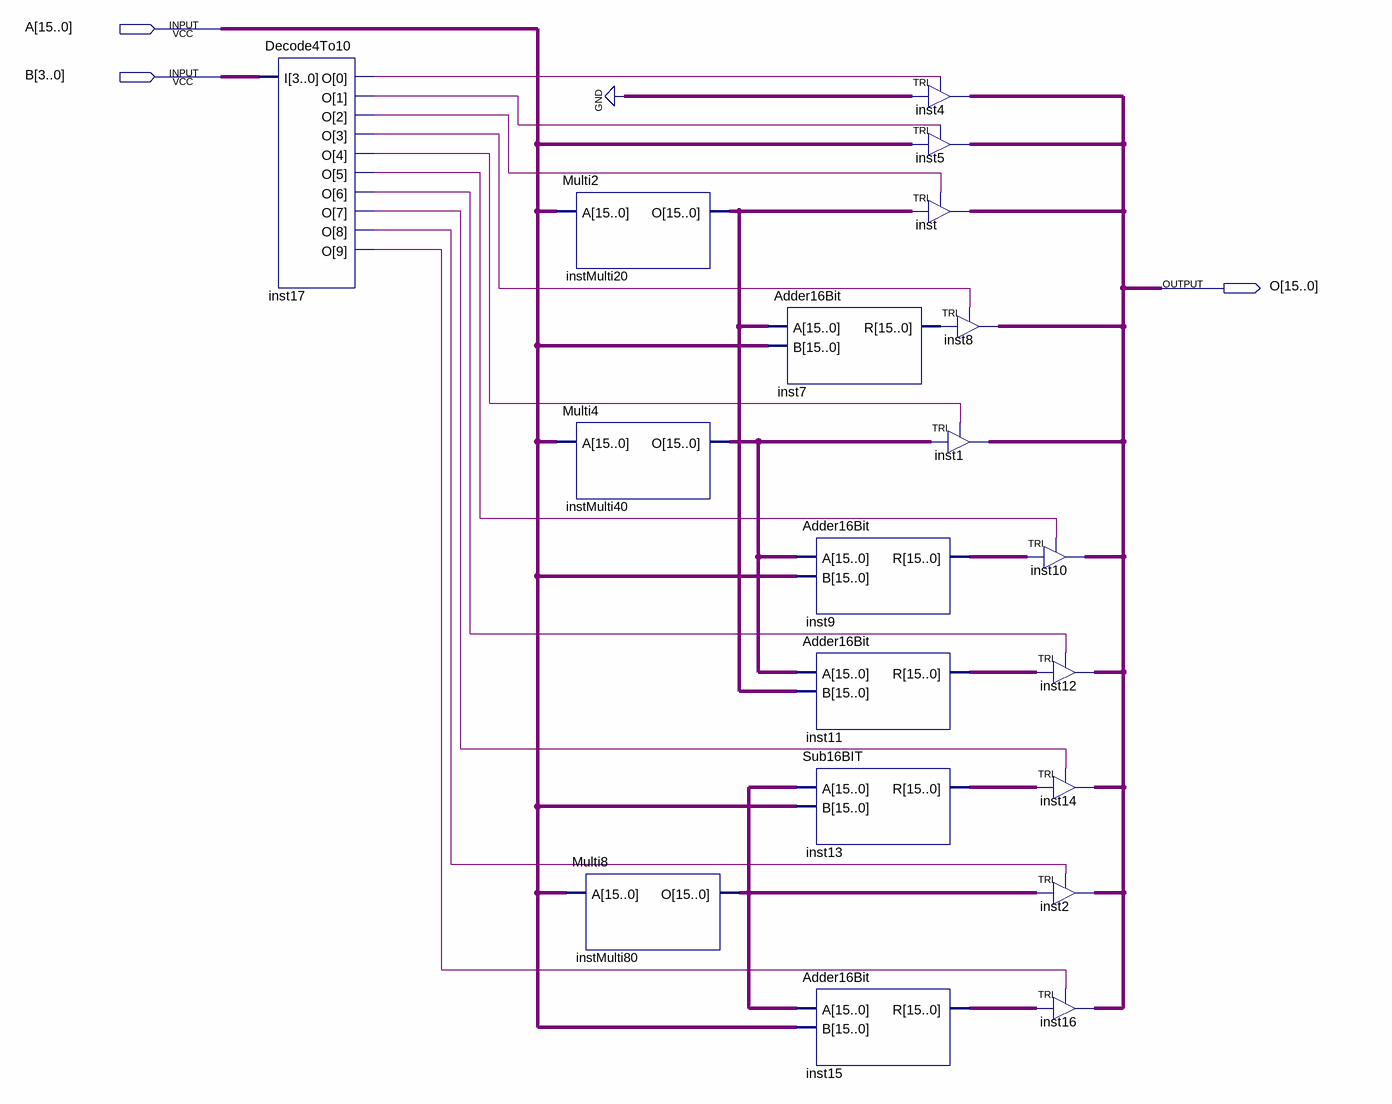
[diagram p0: schematic sheet]
// Quartus schematic Multi16bit.bdf as structural Verilog: 19 symbols, 3 pins
module Multi16bit (
  input  [15:0] A,
  input  [3:0] B,
  output [15:0] O
);

  wire inst17_o, inst17_o_2, inst17_o_3, inst17_o_4, inst17_o_5, inst17_o_6, inst17_o_7, inst17_o_8,
       inst17_o_9, inst17_o_10;
  wire [15:0] inst7_r, inst9_r, inst11_r, inst13_r, inst15_r, instMulti20_o, instMulti40_o, instMulti80_o;

  Decode4To10 inst17 (
    .I(B),
    .O({inst17_o_10, inst17_o_9, inst17_o_8, inst17_o_7, inst17_o_6, inst17_o_5, inst17_o_3, inst17_o_2, inst17_o, inst17_o_4}));
  Multi2 instMulti20 (.A(A), .O(instMulti20_o));
  Multi4 instMulti40 (.A(A), .O(instMulti40_o));
  Multi8 instMulti80 (.A(A), .O(instMulti80_o));
  Adder16Bit inst7 (.A(instMulti20_o), .B(A), .R(inst7_r));
  Adder16Bit inst9 (.A(instMulti40_o), .B(A), .R(inst9_r));
  Adder16Bit inst11 (.A(instMulti40_o), .B(instMulti20_o), .R(inst11_r));
  Sub16BIT inst13 (.A(instMulti80_o), .B(A), .R(inst13_r));
  Adder16Bit inst15 (.A(instMulti80_o), .B(A), .R(inst15_r));
  TRI inst4[15:0] (.IN({16{1'b0}}), .OE(inst17_o_4), .OUT(O));
  TRI inst5[15:0] (.IN(A), .OE(inst17_o), .OUT(O));
  TRI inst[15:0] (.IN(instMulti20_o), .OE(inst17_o_2), .OUT(O));
  TRI inst8[15:0] (.IN(inst7_r), .OE(inst17_o_3), .OUT(O));
  TRI inst1[15:0] (.IN(instMulti40_o), .OE(inst17_o_5), .OUT(O));
  TRI inst10[15:0] (.IN(inst9_r), .OE(inst17_o_6), .OUT(O));
  TRI inst12[15:0] (.IN(inst11_r), .OE(inst17_o_7), .OUT(O));
  TRI inst14[15:0] (.IN(inst13_r), .OE(inst17_o_8), .OUT(O));
  TRI inst2[15:0] (.IN(instMulti80_o), .OE(inst17_o_9), .OUT(O));
  TRI inst16[15:0] (.IN(inst15_r), .OE(inst17_o_10), .OUT(O));
endmodule
